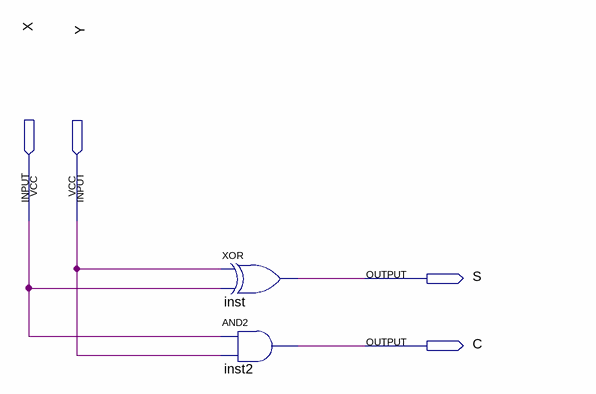
[diagram p0: schematic sheet]
// Quartus schematic HA.bdf as structural Verilog: 2 symbols, 4 pins
module HA (
  input  X,
  input  Y,
  output S,
  output C
);

  xor inst (S, Y, X);
  and inst2 (C, X, Y);
endmodule
